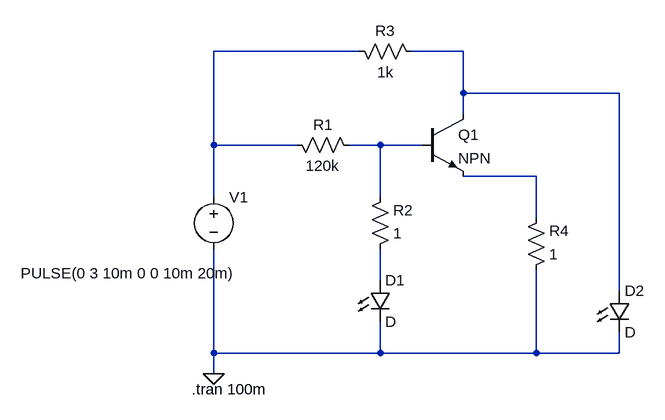
[diagram p0: schematic D-33_v-4-1_1_Tr-inverter.asc]
D-33_v-4-1_1_Tr-inverter.asc, the LTspice schematic file:
Version 4
SHEET 1 880 680
WIRE 192 -32 -32 -32
WIRE 352 -32 272 -32
WIRE 352 32 352 -32
WIRE 592 32 352 32
WIRE 352 64 352 32
WIRE -32 112 -32 -32
WIRE 96 112 -32 112
WIRE 224 112 176 112
WIRE 288 112 224 112
WIRE 464 160 352 160
WIRE -32 192 -32 112
WIRE 224 192 224 112
WIRE 464 224 464 160
WIRE 224 320 224 272
WIRE 592 336 592 32
WIRE -32 432 -32 272
WIRE 224 432 224 384
WIRE 224 432 -32 432
WIRE 464 432 464 304
WIRE 464 432 224 432
WIRE 592 432 592 400
WIRE 592 432 464 432
WIRE -32 464 -32 432
FLAG -32 464 0
SYMBOL npn2 288 64 R0
SYMATTR InstName Q1
SYMBOL res 192 128 M270
WINDOW 0 32 56 VTop 2
WINDOW 3 0 56 VBottom 2
SYMATTR InstName R1
SYMATTR Value 120k
SYMBOL res 208 288 M180
WINDOW 0 36 76 Left 2
WINDOW 3 36 40 Left 2
SYMATTR InstName R2
SYMATTR Value 1
SYMBOL res 288 -16 M270
WINDOW 0 32 56 VTop 2
WINDOW 3 0 56 VBottom 2
SYMATTR InstName R3
SYMATTR Value 1k
SYMBOL res 448 320 M180
WINDOW 0 36 76 Left 2
WINDOW 3 36 40 Left 2
SYMATTR InstName R4
SYMATTR Value 1
SYMBOL LED 208 320 R0
SYMATTR InstName D1
SYMBOL LED 576 336 R0
SYMATTR InstName D2
SYMBOL voltage -32 176 R0
WINDOW 3 -297 133 Left 2
WINDOW 123 0 0 Left 2
WINDOW 39 0 0 Left 2
SYMATTR InstName V1
SYMATTR Value PULSE(0 3 10m 0 0 10m 20m)
TEXT -66 488 Left 2 !.tran 100m

The netlist it stands for:
* D-33_v-4-1_1_Tr-inverter.asc
Q1 N002 N003 N004 0 NPN
R1 N003 N001 120k
R2 N005 N003 1
R3 N002 N001 1k
R4 0 N004 1
D1 N005 0 D
D2 N002 0 D
V1 N001 0 PULSE(0 3 10m 0 0 10m 20m)
.model D D
.lib standard.dio
.model NPN NPN
.model PNP PNP
.lib standard.bjt
.tran 100m
.backanno
.end